# Altium schematic sheet 显示面板.SchDoc
size A4
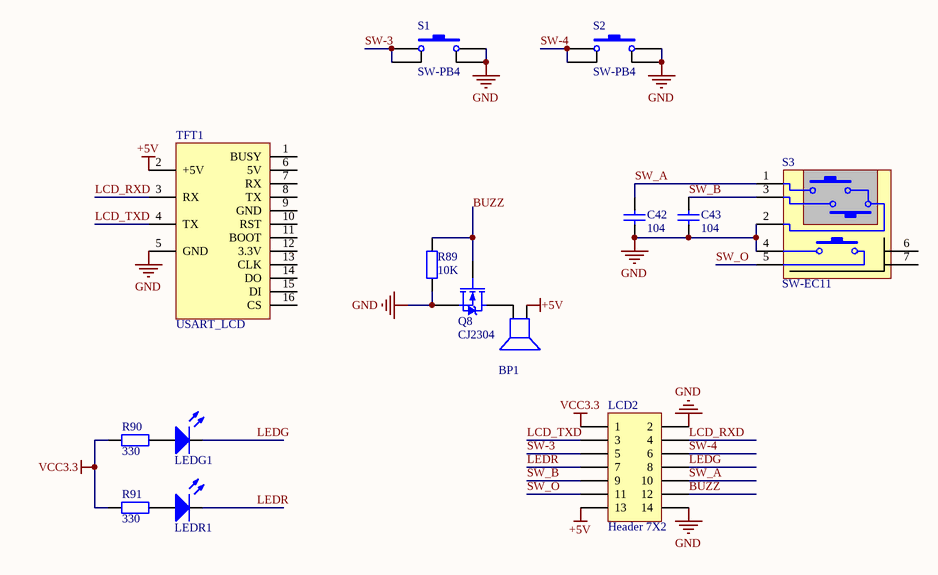
[diagram p0: 显示面板.SchDoc]

## Parts
BP1  BUZZER  [蜂鸣器]  (value not drawn)
C42  value 104  [C-RAD-0603]  (hidden comment: Cap)
C43  value 104  [C-RAD-0603]  (hidden comment: Cap)
LCD2  Header 7X2  [HDR7X2_A1]
LEDG1  COLOUR  [LEDφ6]  (value not drawn)
LEDR1  COLOUR  [LEDφ6]  (value not drawn)
Q8  CJ2304  [SOT-23]
R89  value 10K  [0603-1]  (hidden comment: Res1)
R90  value 330  [0603-1]  (hidden comment: Res1)
R91  value 330  [0603-1]  (hidden comment: Res1)
S1  SW-PB4  [SW_PB4_A1]
S2  SW-PB4  [SW_PB4_A1]
S3  SW-EC11  [EC11]
TFT1  USART_LCD  [3.0寸]

## Nets
+5V: BP1.1(+) LCD2.13 TFT1.2(+5V)
GND: C42.1 C43.1 LCD2.2 LCD2.14 Q8.2(S) R89.1 S1.2 S1.3 S2.2 S2.3 S3.2 S3.4 TFT1.5(GND)
VCC3.3: LCD2.1 R90.2 R91.2
BUZZ: LCD2.12 Q8.1(G) R89.2
LCD_RXD: LCD2.4 TFT1.3(RX)
LCD_TXD: LCD2.3 TFT1.4(TX)
LEDG: LCD2.8 LEDG1.2(-)
LEDR: LCD2.7 LEDR1.2(-)
SW-3: LCD2.5 S1.1 S1.4
SW-4: LCD2.6 S2.1 S2.4
SW_A: C42.2 LCD2.10 S3.1
SW_B: C43.2 LCD2.9 S3.3
SW_O: LCD2.11 S3.5
NetBP1_2: BP1.2(-) Q8.3(D)
NetLEDG1_1: LEDG1.1(+) R90.1
NetLEDR1_1: LEDR1.1(+) R91.1

Not connected (* = marked no-connect by the designer): S3 6 7; TFT1 1(BUSY) 6(5V) 7(RX) 8(TX) 9(GND) 10(RST) 11(BOOT) 12(3.3V) 13(CLK) 14(DO) 15(DI) 16(CS)

## Library data of the parts
BP1 = BUZZER: 蜂鸣器
C42 C43 = Cap: 无极性电容; Published: 8-Jun-2000; LatestRevisionDate: 17-Jul-2002; LatestRevisionNote: Re-released for DXP Platform.; PackageReference: RAD-0.3; Publisher: Altium Limited
LCD2 = Header 7X2: Header, 7-Pin; LatestRevisionDate: 17-Jul-2002; LatestRevisionNote: Re-released for DXP Platform.; Publisher: Altium Limited
LEDG1 LEDR1 = ledφ6
Q8 = MOSFET-N: N-Channel MOSFET; PackageDocument: 1995/1996; Published: 8-Jun-2000; LatestRevisionDate: 17-Jul-2002; LatestRevisionNote: Re-released for DXP Platform.; PackageReference: E3; Publisher: Altium Limited
R89-R91 = Res1: 贴片电阻; Published: 8-Jun-2000; LatestRevisionDate: 17-Jul-2002; LatestRevisionNote: Re-released for DXP Platform.; PackageReference: AXIAL-0.4; Publisher: Altium Limited
S1 S2 = SW-PB4: 微动开关; Published: 24-Mar-1999; LatestRevisionDate: 17-Jul-2002; LatestRevisionNote: Re-released for DXP Platform.; PackageReference: SPST-2; Publisher: Altium Limited
S3 = SW-EC11: 旋转编码开关; Published: 24-Mar-1999; LatestRevisionDate: 17-Jul-2002; LatestRevisionNote: Re-released for DXP Platform.; PackageReference: SPST-2; Publisher: Altium Limited
TFT1 = USART_LCD: usart串口屏